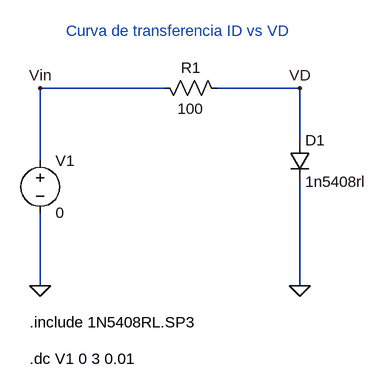
[diagram p0: schematic sum_diodo.asc]
sum_diodo.asc, the LTspice schematic file:
Version 4
SHEET 1 880 680
WIRE 112 0 -80 0
WIRE 320 0 192 0
WIRE 320 80 320 0
WIRE -80 112 -80 0
WIRE -80 304 -80 192
WIRE 320 304 320 144
FLAG -80 304 0
FLAG 320 304 0
FLAG -80 0 Vin
FLAG 320 0 VD
SYMBOL voltage -80 96 R0
SYMATTR InstName V1
SYMATTR Value 0
SYMBOL res 208 16 M270
WINDOW 0 32 56 VTop 2
WINDOW 3 0 56 VBottom 2
SYMATTR InstName R1
SYMATTR Value 100
SYMBOL diode 304 80 R0
SYMATTR InstName D1
SYMATTR Value 1n5408rl
TEXT -40 -88 Left 2 ;Curva de transferencia ID vs VD
TEXT -96 360 Left 2 !.include 1N5408RL.SP3
TEXT -96 416 Left 2 !.dc V1 0 3 0.01

The netlist it stands for:
* sum_diodo.asc
V1 Vin 0 0
R1 VD Vin 100
D1 VD 0 1n5408rl
.model D D
.lib standard.dio
* Curva de transferencia ID vs VD
.include 1N5408RL.SP3
.dc V1 0 3 0.01
.backanno
.end

* Results of the author's LTspice run, read from the files saved beside the schematic
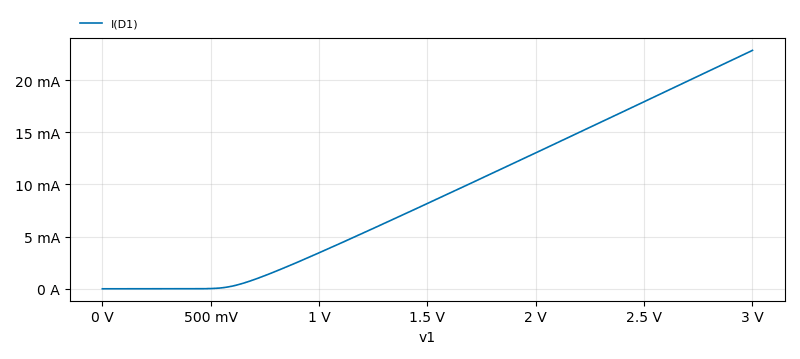
[diagram p1: DC transfer characteristic of sum_diodo.asc, plotted from the saved traces]
* DC transfer characteristic, 1 run:
*   I(D1): 0 A at v1=0 V, 22.86 mA at v1=3 V, min 0 A, max 22.86 mA